# Altium schematic sheet JTAG1.SchDoc: Animated Archer Main PCB
size Letter; Author: John Eric Martin; Engineer: John Eric Martin; Organization: UCCS IEEE Robotics; Address1: 1420 Austin Bluffs Pkwy; Address2: Colorado Springs, CO 80918; DocumentNumber: JTAG1; Revision: 1; SheetNumber: 5; SheetTotal: 8; ProjectName: Animated Archer Quadcopter
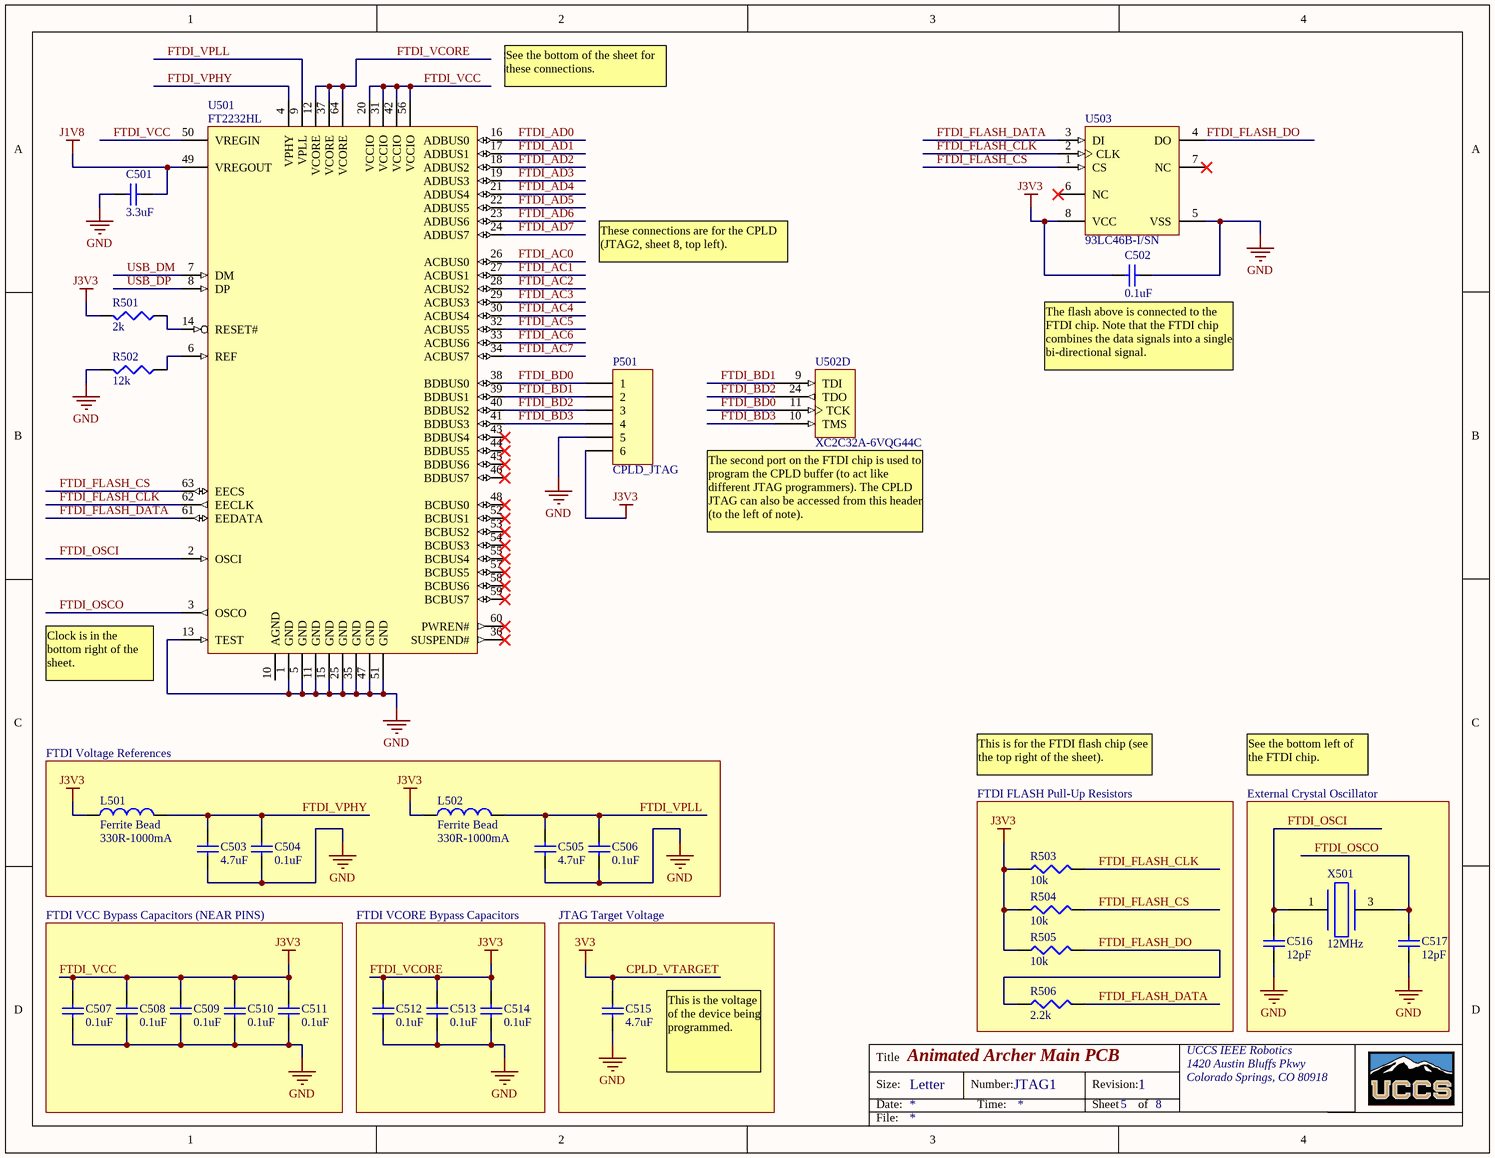
[diagram p0: JTAG1.SchDoc]

## Parts
C501  value 3.3uF  [1608[0603]]  (hidden comment: 0.1uF)
C502  0.1uF  [1608[0603]]
C503  value 4.7uF  [1608[0603]]  (hidden comment: 0.1uF)
C504  0.1uF  [1608[0603]]
C505  value 4.7uF  [1608[0603]]  (hidden comment: 0.1uF)
C506  0.1uF  [1608[0603]]
C507  0.1uF  [1608[0603]]
C508  0.1uF  [1608[0603]]
C509  0.1uF  [1608[0603]]
C510  0.1uF  [1608[0603]]
C511  0.1uF  [1608[0603]]
C512  0.1uF  [1608[0603]]
C513  0.1uF  [1608[0603]]
C514  0.1uF  [1608[0603]]
C515  value 4.7uF  [1608[0603]]  (hidden comment: 0.1uF)
C516  value 12pF  [1608[0603]]  (hidden comment: 0.1uF)
C517  value 12pF  [1608[0603]]  (hidden comment: 0.1uF)
L501  Ferrite Bead  value 330R-1000mA  [0603]
L502  Ferrite Bead  value 330R-1000mA  [0603]
P501  CPLD_JTAG  [HDR1X6]
R501  value 2k  [J1-0603]  (hidden comment: Res3)
R502  value 12k  [J1-0603]  (hidden comment: Res3)
R503  value 10k  [J1-0603]  (hidden comment: Res3)
R504  value 10k  [J1-0603]  (hidden comment: Res3)
R505  value 10k  [J1-0603]  (hidden comment: Res3)
R506  value 2.2k  [J1-0603]  (hidden comment: Res3)
U501  FT2232HL  [LQFP-64_N]
U502  XC2C32A-6VQG44C  [VQG44_N]  (part D of 6)
U503  93LC46B-I/SN  [SOIC-SN8_N]
X501  12MHz  [CTS405XTAL]

## Blocks framed on the sheet
FTDI Voltage References: C503-C506 L501 L502
FTDI FLASH Pull-Up Resistors: R503-R506
External Crystal Oscillator: C516 C517 X501
FTDI VCC Bypass Capacitors (NEAR PINS): C507-C511
FTDI VCORE Bypass Capacitors: C512-C514
JTAG Target Voltage: C515

## Nets
CPLD_VTARGET: C515.2  [also labelled 3V3]
FTDI_VCC: C502.2 C507.2 C508.2 C509.2 C510.2 C511.2 C512.2 C513.2 C514.2 L501.1 L502.1 P501.6 R501.2 R503.1 R504.1 R505.1 U501.12(VCORE) U501.20(VCCIO) U501.31(VCCIO) U501.37(VCORE) U501.42(VCCIO) U501.50(VREGIN) U501.56(VCCIO) U501.64(VCORE) U503.8(VCC)  [also labelled FTDI_VCORE, J3V3]
GND: C501.1 C502.1 C503.1 C504.1 C505.1 C506.1 C507.1 C508.1 C509.1 C510.1 C511.1 C512.1 C513.1 C514.1 C515.1 C516.1 C517.1 P501.5 R502.2 U501.1(GND) U501.5(GND) U501.11(GND) U501.13(TEST) U501.15(GND) U501.25(GND) U501.35(GND) U501.47(GND) U501.51(GND) U503.5(VSS)
J1V8: C501.2 U501.49(VREGOUT)
FTDI_AC0: U501.26(ACBUS0)
FTDI_AC1: U501.27(ACBUS1)
FTDI_AC2: U501.28(ACBUS2)
FTDI_AC3: U501.29(ACBUS3)
FTDI_AC4: U501.30(ACBUS4)
FTDI_AC5: U501.32(ACBUS5)
FTDI_AC6: U501.33(ACBUS6)
FTDI_AC7: U501.34(ACBUS7)
FTDI_AD0: U501.16(ADBUS0)
FTDI_AD1: U501.17(ADBUS1)
FTDI_AD2: U501.18(ADBUS2)
FTDI_AD3: U501.19(ADBUS3)
FTDI_AD4: U501.21(ADBUS4)
FTDI_AD5: U501.22(ADBUS5)
FTDI_AD6: U501.23(ADBUS6)
FTDI_AD7: U501.24(ADBUS7)
FTDI_BD0: P501.1 U501.38(BDBUS0) U502.11(TCK)
FTDI_BD1: P501.2 U501.39(BDBUS1) U502.9(TDI)
FTDI_BD2: P501.3 U501.40(BDBUS2) U502.24(TDO)
FTDI_BD3: P501.4 U501.41(BDBUS3) U502.10(TMS)
FTDI_FLASH_CLK: R503.2 U501.62(EECLK) U503.2(CLK)
FTDI_FLASH_CS: R504.2 U501.63(EECS) U503.1(CS)
FTDI_FLASH_DATA: R506.2 U501.61(EEDATA) U503.3(DI)
FTDI_FLASH_DO: R505.2 R506.1 U503.4(DO)
FTDI_OSCI: C516.2 U501.2(OSCI) X501.1
FTDI_OSCO: C517.2 U501.3(OSCO) X501.3
FTDI_VPHY: C503.2 C504.2 L501.2 U501.4(VPHY)
FTDI_VPLL: C505.2 C506.2 L502.2 U501.9(VPLL)
USB_DM: U501.7(DM)
USB_DP: U501.8(DP)
NetR501_1: R501.1 U501.14(RESET#)
NetR502_1: R502.1 U501.6(REF)

Not connected (* = marked no-connect by the designer): U501 10(AGND) 36(SUSPEND#)* 43(BDBUS4)* 44(BDBUS5)* 45(BDBUS6)* 46(BDBUS7)* 48(BCBUS0)* 52(BCBUS1)* 53(BCBUS2)* 54(BCBUS3)* 55(BCBUS4)* 57(BCBUS5)* 58(BCBUS6)* 59(BCBUS7)* 60(PWREN#)*; U503 6(NC)* 7(NC)*

## Notes on the sheet
- (near U501) See the bottom of the sheet for these connections.
- These connections are for the CPLD (JTAG2, sheet 8, top left).
- (near C502) The flash above is connected to the FTDI chip. Note that the FTDI chip combines the data signals into a single bi-directional signal.
- (near U502) The second port on the FTDI chip is used to program the CPLD buffer (to act like different JTAG programmers). The CPLD JTAG can also be accessed from this header (to the left of note).
- Clock is in the bottom right of the sheet.
- This is for the FTDI flash chip (see the top right of the sheet).
- See the bottom left of the FTDI chip.
- This is the voltage of the device being programmed.
- Title
- Size:
- Date:
- Letter
- Number:
- Time:
- Revision:
- Sheet
- of
- File:

## Library data of the parts
C501-C517 = Cap Semi: Capacitor (Semiconductor SIM Model); Published: 8-Jun-2000; LatestRevisionDate: 29-May-2009; LatestRevisionNote: IPC-7351 Footprint Added.; PackageReference: C1206; Publisher: Altium Limited; PackageDescription: Chip Capacitor
  C502 C504 C506-C514: Value: 0.1uF
L501 L502 = Inductor: Code_IEC: 1005; Published: 8-Jun-2000; LatestRevisionDate: 29-May-2009; LatestRevisionNote: IPC-7351 Footprint Added.; PackageReference: 0402-A; Publisher: Altium Limited; PackageDescription: Chip Inductor; Code_JEITA: 0402
P501 = Header 6: Header, 6-Pin; LatestRevisionDate: 17-Jul-2002; LatestRevisionNote: Re-released for DXP Platform.; Publisher: Altium Limited
R501-R506 = Res3: Resistor; Published: 8-Jun-2000; LatestRevisionDate: 29-May-2009; LatestRevisionNote: IPC-7351 Footprint Added.; PackageReference: J1-0603; Publisher: Altium Limited; PackageDescription: Chip Resistor
U501 = FT2232HL: Dual High Speed USB To Multipurpose UART/FIFO IC, LQFP-64, Tape and Reel; Published: 19-Aug-2010; DatasheetVersion: ver 2.08, May-2010; PackageVersion: 2010; PackageReference: LQFP-64; Publisher: Altium Limited; PackageDescription: 64-Pin Thin Quad Flat Pack, 10 x 10 x 1.4 mm Body, 0.5 mm Pitch; ComponentLink1Description: Manufacturer Link; ComponentLink1URL: http://www.ftdichip.com/Products/ICs/FT2232H.htm; ComponentLink2Description: Datasheet; ComponentLink2URL: http://www.ftdichip.com/Support/Documents/DataSheets/ICs/DS_FT2232H.pdf
U502 = XC2C32A-6VQG44C: CoolRunner-II 1.8V, 32 Macrocell CPLD, 33 User I/Os, 44-Pin VQFP, Commercial Grade, Pb-Free; Published: 4-Mar-2005; LatestRevisionDate: 30-Oct-2009; LatestRevisionNote: Updated to datasheet version 3.1 Sep-2008.; DatasheetVersion: ver2.1, Nov-2008; PackageVersion: ver1.2, Jun-2004; PackageReference: VQG44; Publisher: Altium Limited; PackageDescription: 44-Pin Very Thin Quad Flat Pack (VQG44) - Pb-Free; Supplier 1: Digi-Key; Supplier Part Number 1: 122-1404-ND; Code_JEDEC: MS-026-ACB; ComponentLink1Description: XC2C32A Datasheet; ComponentLink1URL: http://www.xilinx.com/support/documentation/data_sheets/ds310.pdf; ComponentLink2Description: Discontinuation Notice; ComponentLink2URL: http://www.xilinx.com/support/documentation/customer_notices/xcn07022.pdf; ComponentLink3Description: VQG44 Package Drawing; ComponentLink3URL: http://www.xilinx.com/support/documentation/package_specs/vq44.pdf; ComponentLink4Description: CoolRunner-II Documents; ComponentLink4URL: http://www.xilinx.com/support/documentation/coolrunner-ii.htm; ComponentLink5Description: Xilinx.com Home; ComponentLink5URL: http://www.xilinx.com
U503 = 93LC46B-I/SN: 1K, 64x16-bit, 2.5V Microwire Serial EEPROM, 8-Pin SOIC 150mil, Industrial Temperature; Published: 29-Jan-2009; DatasheetVersion: revG, May-2008; PackageVersion: revBB, Aug-2009; PackageReference: SOIC-SN8; Publisher: Altium Limited; PackageDescription: 8-Lead Plastic Small Outline (SN) - Narrow, 3.90mm Body [SOIC]; Supplier 1: Digi-Key; Supplier Part Number 1: 93LC46B-I/SN-ND; Supplier 2: Farnell; Supplier Part Number 2: 9758232; Code_JEDEC: MS-012; Code_IPC: SOIC127P600-8; ComponentLink1Description: Datasheet; ComponentLink1URL: http://ww1.microchip.com/downloads/en/DeviceDoc/21749G.pdf; ComponentLink2Description: Packaging Specification; ComponentLink2URL: http://www.microchip.com/stellent/groups/techpub_sg/documents/packagingspec/en012702.pdf; ComponentLink3Description: Microchip.com Home; ComponentLink3URL: http://www.microchip.com/
X501 = CTS405XTAL: CTS 405 Surface Mount Quartz Crystal (405C35B12M00000); Supplier 1: Mouser; Supplier 2: Digi-Key; Supplier 3: Digi-Key; Supplier 4: Arrow; Supplier 5: Digi-Key